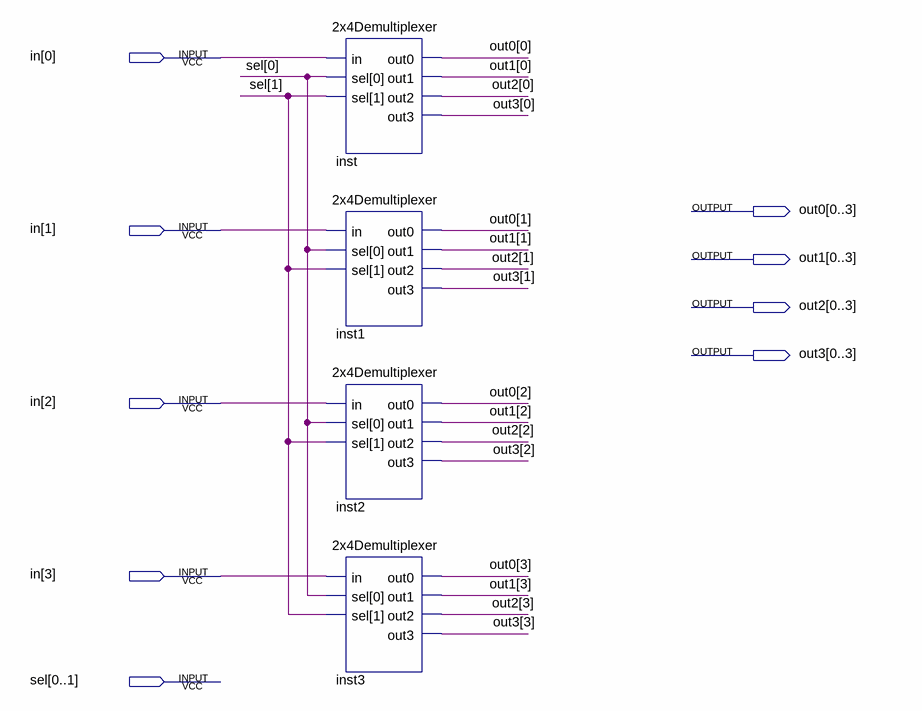
[diagram p0: schematic sheet]
// Quartus schematic 4x4Demultiplexer.bdf as structural Verilog: 4 symbols, 9 pins
module \4x4Demultiplexer  (
  input  [3:0] in,
  input  [0:1] sel,
  output [0:3] out0,
  output [0:3] out1,
  output [0:3] out2,
  output [0:3] out3
);

  \2x4Demultiplexer  inst (
    .in(in[0]), .sel({sel[1], sel[0]}), .out0(out0[0]), .out1(out1[0]), .out2(out2[0]), .out3(out3[0]));
  \2x4Demultiplexer  inst1 (
    .in(in[1]), .sel({sel[1], sel[0]}), .out0(out0[1]), .out1(out1[1]), .out2(out2[1]), .out3(out3[1]));
  \2x4Demultiplexer  inst2 (
    .in(in[2]), .sel({sel[1], sel[0]}), .out0(out0[2]), .out1(out1[2]), .out2(out2[2]), .out3(out3[2]));
  \2x4Demultiplexer  inst3 (
    .in(in[3]), .sel({sel[1], sel[0]}), .out0(out0[3]), .out1(out1[3]), .out2(out2[3]), .out3(out3[3]));
endmodule
